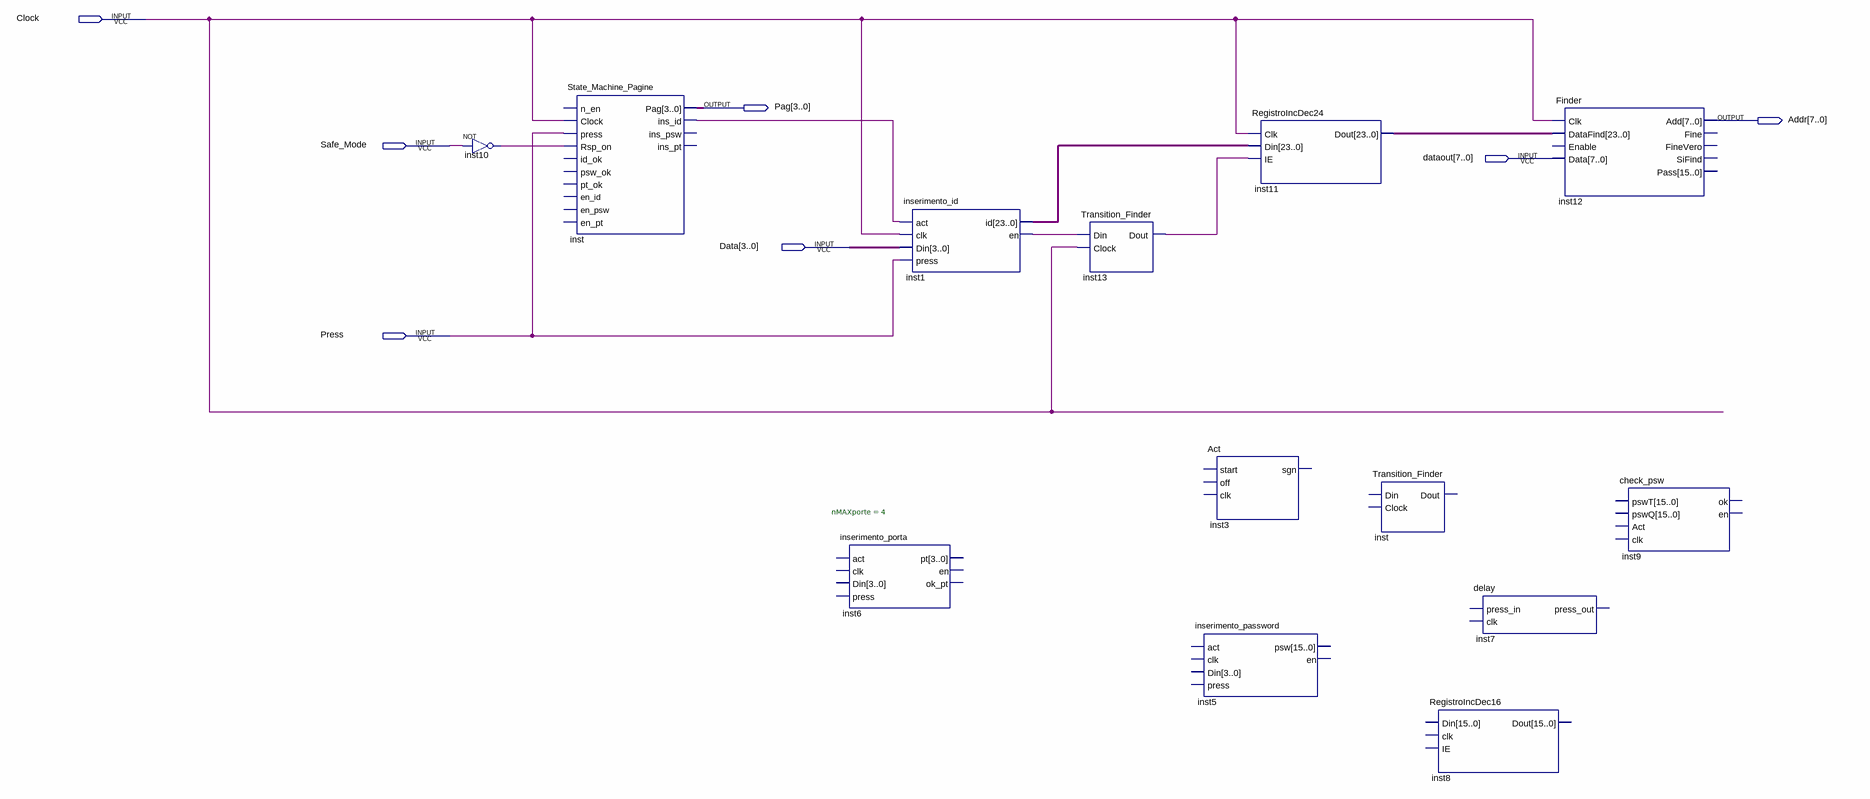
[diagram p0: schematic sheet]
// Quartus schematic Safe_Mode.bdf as structural Verilog: 13 symbols, 7 pins
module Safe_Mode (
  input  Clock,
  input  Safe_Mode,
  input  [7:0] dataout,
  input  [3:0] Data,
  input  Press,
  output [3:0] Pag,
  output [7:0] Addr
);

  wire inst1_en, inst10_out, inst13_dout, inst_ins_id;
  wire [23:0] inst1_id, inst11_dout;

  not inst10 (inst10_out, Safe_Mode);
  State_Machine_Pagine inst (
    .Clock(Clock), .press(Press), .Rsp_on(inst10_out), .Pag(Pag), .ins_id(inst_ins_id));  // open: n_en, id_ok, psw_ok, pt_ok, en_id, en_psw, en_pt, ins_psw, ins_pt
  inserimento_porta #(.nMAXporte(4)) inst6 ();  // open: act, clk, Din, press, en, ok_pt, pt
  inserimento_id inst1 (.act(inst_ins_id), .clk(Clock), .Din(Data), .press(Press), .en(inst1_en), .id(inst1_id));
  Transition_Finder inst13 (.Din(inst1_en), .Clock(Clock), .Dout(inst13_dout));
  Act inst3 ();  // open: start, off, clk, sgn
  inserimento_password inst5 ();  // open: act, clk, Din, press, en, psw
  RegistroIncDec24 inst11 (.Clk(Clock), .Din(inst1_id), .IE(inst13_dout), .Dout(inst11_dout));
  Transition_Finder inst_dup2 ();  // open: Din, Clock, Dout
  RegistroIncDec16 inst8 ();  // open: Din, clk, IE, Dout
  delay inst7 ();  // open: press_in, clk, press_out
  Finder inst12 (
    .Clk(Clock), .DataFind(inst11_dout), .Data(dataout), .Add(Addr));  // open: Enable, Fine, FineVero, SiFind, Pass
  check_psw inst9 ();  // open: pswT, pswQ, Act, clk, ok, en
endmodule
